# Altium schematic sheet 如意硬件系统模块0831.SchDoc
size C
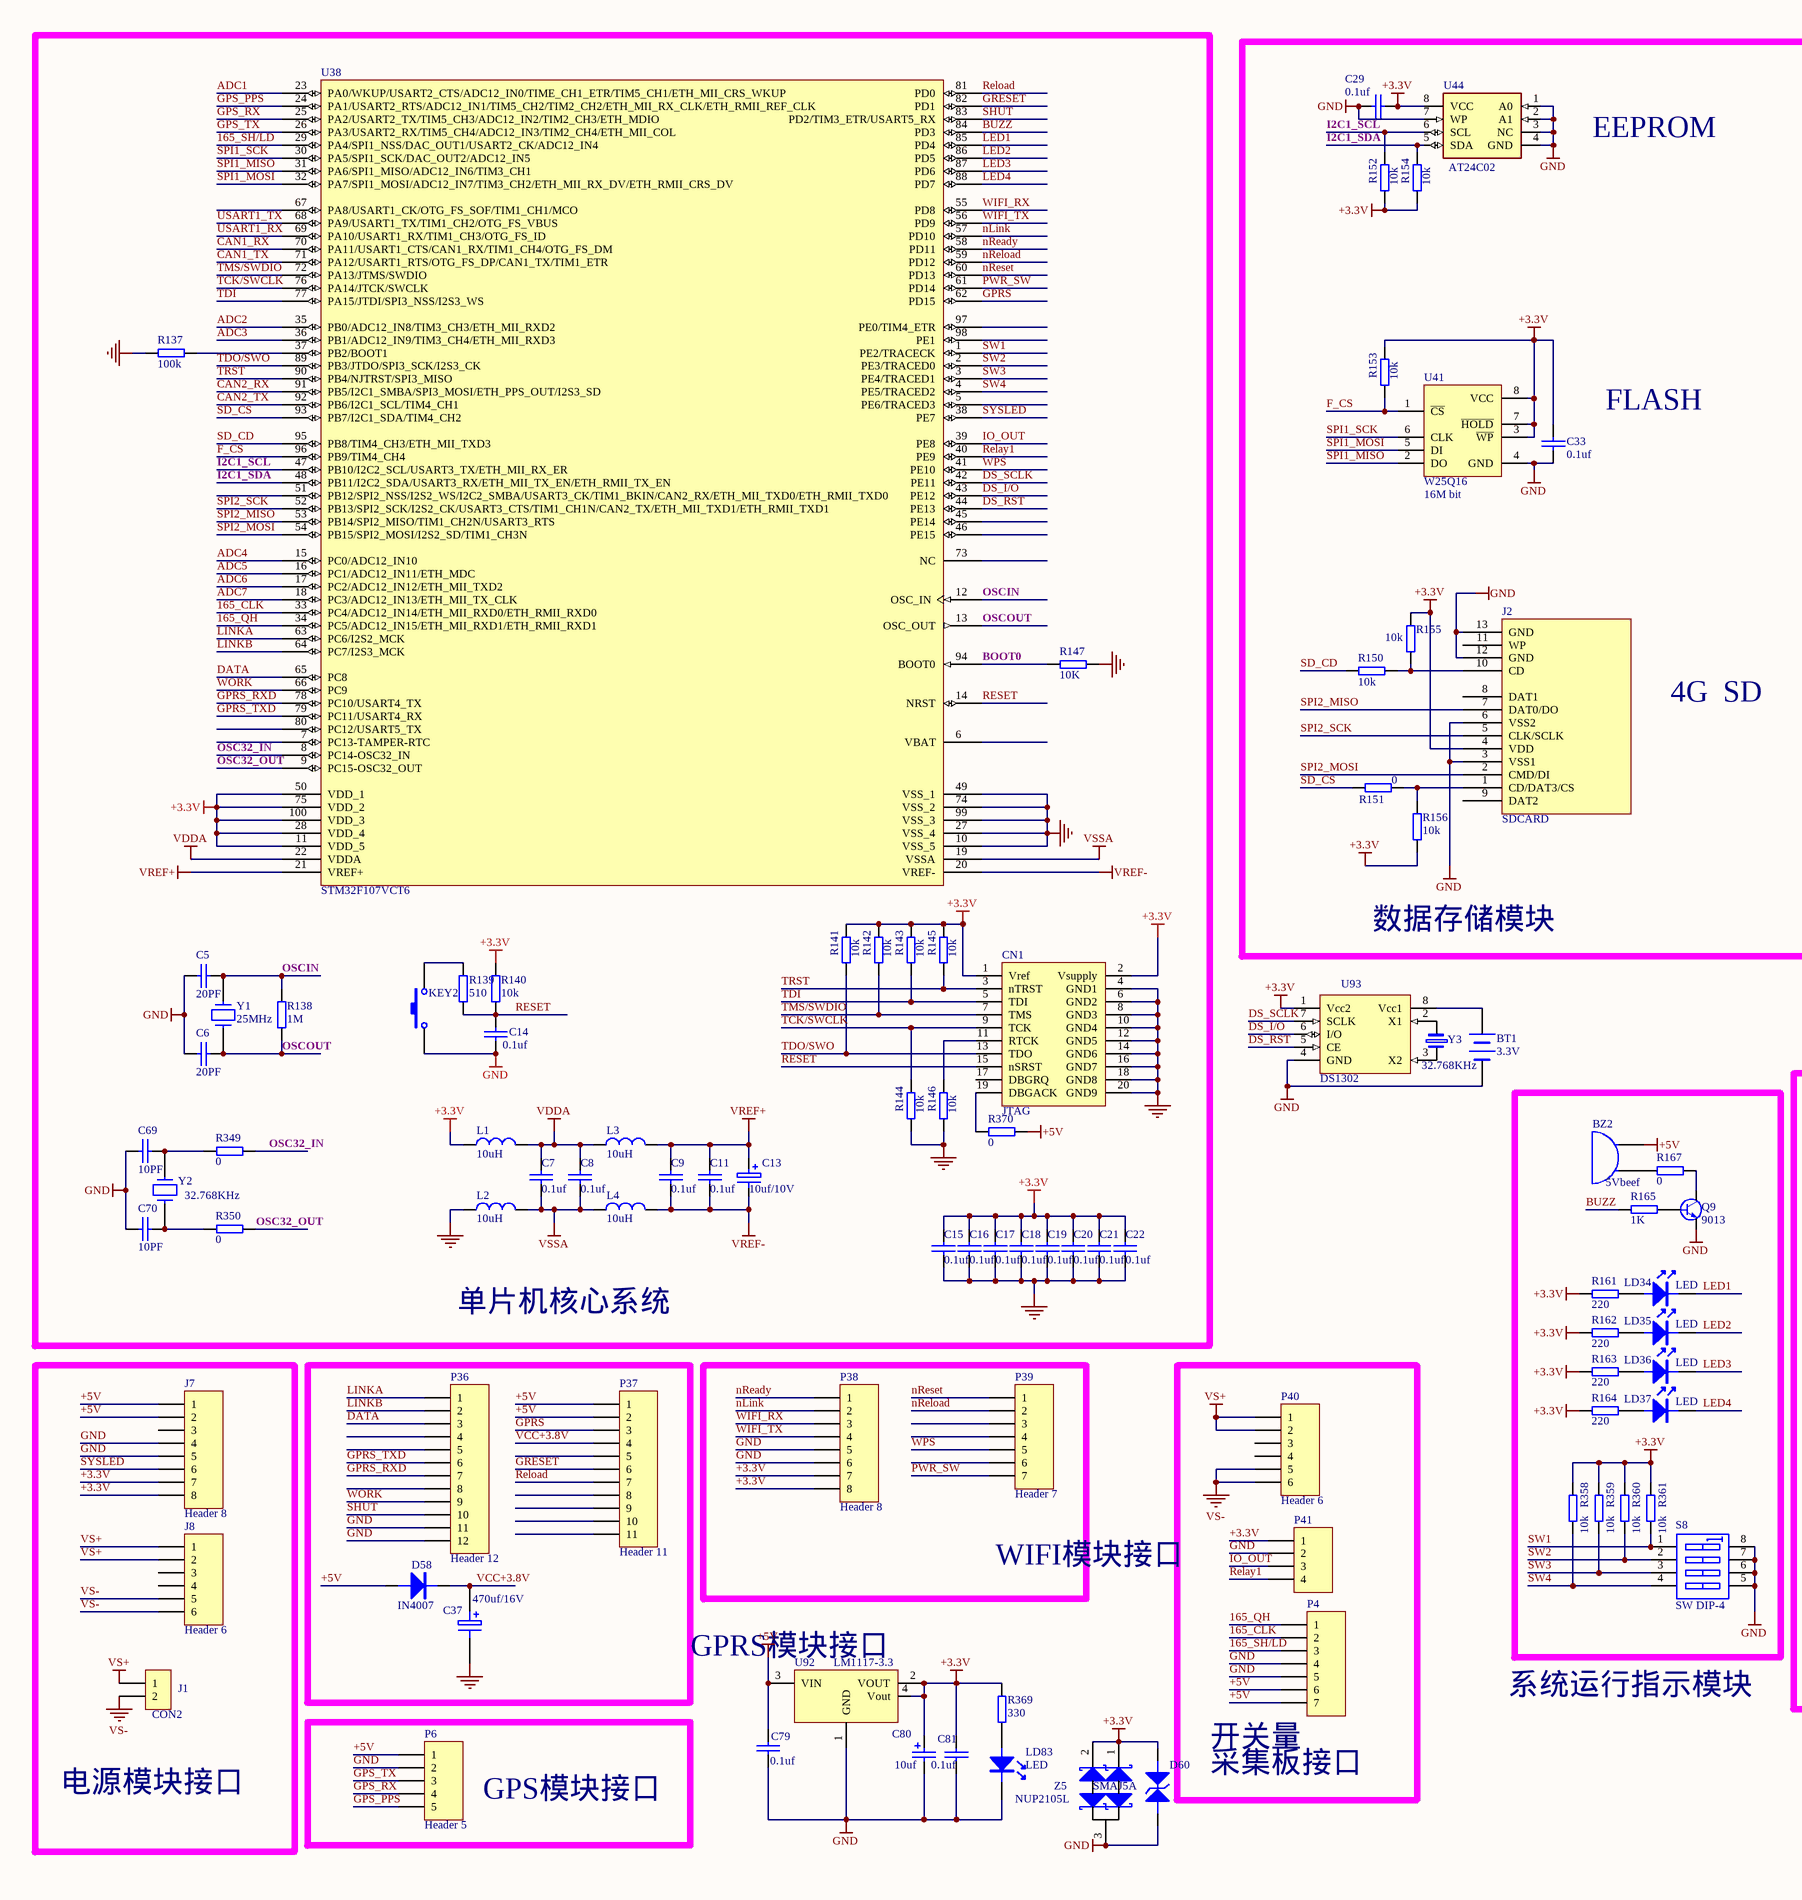
[diagram p0: 如意硬件系统模块0831.SchDoc, left]
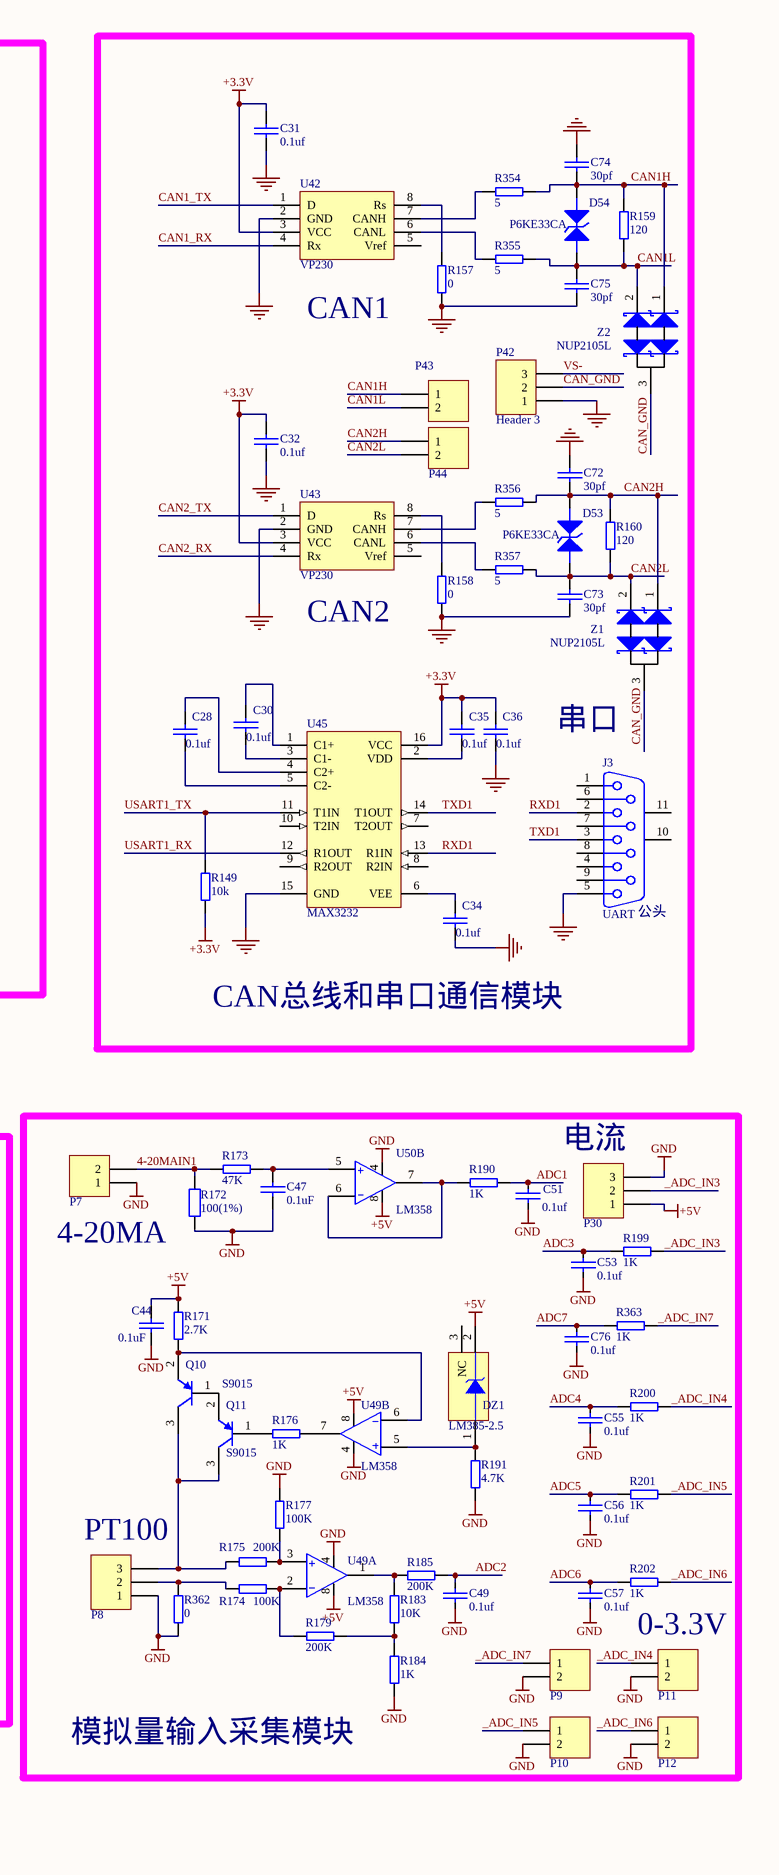
[diagram p1: 如意硬件系统模块0831.SchDoc, right]

## Parts
BT1  3.3V  [BT2]
BZ2  5Vbeef  [BEEP]
C5  20PF  [0603C-1]
C6  20PF  [0603C-1]
C7  0.1uf  [0603C-1]
C8  0.1uf  [0603C-1]
C9  0.1uf  [0603C-1]
C11  0.1uf  [0603C-1]
C13  10uf/10V  [1206D-S]
C14  0.1uf  [0603C-1]
C15  0.1uf  [0603C-1]
C16  0.1uf  [0603C-1]
C17  0.1uf  [0603C-1]
C18  0.1uf  [0603C-1]
C19  0.1uf  [0603C-1]
C20  0.1uf  [0603C-1]
C21  0.1uf  [0603C-1]
C22  0.1uf  [0603C-1]
C28  0.1uf  [0603C-1]
C29  0.1uf  [0603C-1]
C30  0.1uf  [0603C-1]
C31  0.1uf  [0603C-1]
C32  0.1uf  [0603C-1]
C33  0.1uf  [0603C-1]
C34  0.1uf  [0603C-1]
C35  0.1uf  [0603C-1]
C36  0.1uf  [0603C-1]
C37  470uf/16V  [C-RB-10]
C44  0.1uF  [0603C-1]
C47  0.1uF  [0603C-1]
C49  0.1uf  [0805-1]
C51  0.1uf  [0603C-1]
C53  0.1uf  [0603C-1]
C55  0.1uf  [0603C-1]
C56  0.1uf  [0603C-1]
C57  0.1uf  [0603C-1]
C69  10PF  [0603C-1]
C70  10PF  [0603C-1]
C72  30pf  [0805-1]
C73  30pf  [0805-1]
C74  30pf  [0805-1]
C75  30pf  [0805-1]
C76  0.1uf  [0603C-1]
C79  0.1uf  [0603C-1]
C80  10uf  [1206D-S]
C81  0.1uf  [0603C-1]
CN1  JTAG  [JTAG20 - 15]
D53  P6KE33CA  [SMB]
D54  P6KE33CA  [SMB]
D58  IN4007  [SMB]
D60  SMAJ5A  [SMB]
DZ1  LM385-2.5  [TO-92A]
J1  CON2  [JXZ-2]
J2  SDCARD  [SDC009-01-R2]
J3  UART  [DB9-M]
J7  Header 8  [HDR1X8]
J8  Header 6  [HDR1X6]
KEY2  SW-PB  [SW_PB4_A1]  (value not drawn)
L1  value 10uH  [1206]  (hidden comment: Inductor)
L2  value 10uH  [1206]  (hidden comment: Inductor)
L3  value 10uH  [1206]  (hidden comment: Inductor)
L4  value 10uH  [1206]  (hidden comment: Inductor)
LD34  LED  [LED_0805]
LD35  LED  [LED_0805]
LD36  LED  [LED_0805]
LD37  LED  [LED_0805]
LD83  LED  [LED_0805]
P4  Header 7  [HDR1X7]  (value not drawn)
P6  Header 5  [HDR1X5]
P7  Header 2  [KF3.81-2P]  (value not drawn)
P8  Header 3  [KF3.81-3P]  (value not drawn)
P9  Header 2  [KF3.81-2P]  (value not drawn)
P10  Header 2  [KF3.81-2P]  (value not drawn)
P11  Header 2  [KF3.81-2P]  (value not drawn)
P12  Header 2  [KF3.81-2P]  (value not drawn)
P30  Header 3  [KF3.81-3P]  (value not drawn)
P36  Header 12  [HDR1X12]
P37  Header 11  [HDR1X11]
P38  Header 8  [HDR1X8]
P39  Header 7  [HDR1X7]
P40  Header 6  [HDR1X6]
P41  Header 4  [HDR1X4]  (value not drawn)
P42  Header 3  [HDR1X3]
P43  Header 2  [KF3.81-2P]  (value not drawn)
P44  Header 2  [KF3.81-2P]  (value not drawn)
Q9  9013  [SOT23-BCE]
Q10  S9015  [SOT-23]
Q11  S9015  [SOT-23]
R137  100k  [0603R-1]
R138  1M  [0603R-1]
R139  510  [0603R-1]
R140  10k  [0603R-1]
R141  10k  [0603R-1]
R142  10k  [0603R-1]
R143  10k  [0603R-1]
R144  10k  [0603R-1]
R145  10k  [0603R-1]
R146  10k  [0603R-1]
R147  10K  [0603R-1]
R149  10k  [0603R-1]
R150  10k  [0603R-1]
R151  0  [0603R-1]
R152  10k  [0603R-1]
R153  10k  [0603R-1]
R154  10k  [0603R-1]
R155  10k  [0603R-1]
R156  10k  [0603R-1]
R157  0  [0603R-1]
R158  0  [0603R-1]
R159  120  [0805-1]
R160  120  [0805-1]
R161  220  [0603R-1]
R162  220  [0603R-1]
R163  220  [0603R-1]
R164  220  [0603R-1]
R165  1K  [0603R-1]
R167  0  [0603R-1]
R171  2.7K  [AXIAL0.4]
R172  100(1%)  [AXIAL0.4]
R173  47K  [0603R-1]
R174  100K  [0805-1]
R175  200K  [0805-1]
R176  1K  [0603R-1]
R177  100K  [0805-1]
R179  200K  [0805-1]
R183  10K  [0805-1]
R184  1K  [0805-1]
R185  200K  [0805-1]
R190  1K  [0603R-1]
R191  4.7K  [0603R-1]
R199  1K  [0603R-1]
R200  1K  [0603R-1]
R201  1K  [0603R-1]
R202  1K  [0603R-1]
R349  0  [0603R-1]
R350  0  [0603R-1]
R354  5  [0805-1]
R355  5  [0805-1]
R356  5  [0805-1]
R357  5  [0805-1]
R358  10k  [0603R-1]
R359  10k  [0603R-1]
R360  10k  [0603R-1]
R361  10k  [0603R-1]
R362  0  [0603R-1]
R363  1K  [0603R-1]
R369  330  [0603R-1]
R370  0  [0603R-1]
S8  SW DIP-4  [DIP-8]
U38  STM32F107VCT6  [LQFP100_M]
U41  W25Q16  Memory: 16M bit  [SOIC8_W]
U42  VP230  [NSO8_N]
U43  VP230  [NSO8_N]
U44  AT24C02  [SO-8]
U45  MAX3232  [NSO16_M]
U49  LM358  [SO-8]  (parts A,B of 2)
U50  LM358  [SO-8]  (part B of 2)
U92  LM1117-3.3  [ASM1117]
U93  DS1302  [SO-8]
Y1  25MHz  [XTAL1]
Y2  32.768KHz  [XTAL4]
Y3  32.768KHz  [XTAL5]
Z1  NUP2105L  [SOT-23]
Z2  NUP2105L  [SOT-23]
Z5  NUP2105L  [SOT-23]

## Blocks framed on the sheet
单片机核心系统: C5-C9 C11 C13-C22 C69 C70 CN1 KEY2 L1-L4 R137-R147 R349 R350 R370 U38 Y1 Y2
电源模块接口: J1 J7 J8
WIFI模块接口: P38 P39
GPS模块接口: P6

## Nets
+3.3V: C15.2 C16.2 C17.2 C18.2 C19.2 C20.2 C21.2 C22.2 C29.2 C31.2 C32.2 C33.2 C35.2 C36.2 C80.1 C81.2 CN1.1(Vref) CN1.2(Vsupply) D60.2(K) J2.4(VDD) J7.7 J7.8 L1.1 P38.7 P38.8 P41.1 R140.2 R141.2 R142.2 R143.2 R145.2 R149.2 R152.1 R153.2 R154.1 R155.1 R156.2 R161.1 R162.1 R163.1 R164.1 R358.2 R359.2 R360.2 R361.2 R369.1 U38.11(VDD_5) U38.28(VDD_4) U38.50(VDD_1) U38.75(VDD_2) U38.100(VDD_3) U41.3(~{WP}) U41.7(~{HOLD}) U41.8(VCC) U42.3(VCC) U43.3(VCC) U44.8(VCC) U45.16(VCC) U92.2(VOUT) U92.4(Vout) U93.1(Vcc2) Z5.1 Z5.2
+5V: BZ2.1(A) C44.2 C79.2 D58.1(A) DZ1.2(V+) J7.1 J7.2 P4.6 P4.7 P6.1 P30.1 P37.1 P37.2 R171.2 R370.1 U49.8(VCC) U50.8(VCC) U92.3(VIN)
GND: BT1.2(-) C5.1 C6.1 C14.2 C15.1 C16.1 C17.1 C18.1 C19.1 C20.1 C21.1 C22.1 C29.1 C31.1 C32.1 C33.1 C34.1 C36.1 C37.2 C44.1 C47.1 C49.2 C51.2 C53.2 C55.2 C56.2 C57.2 C69.1 C70.1 C72.2 C73.1 C74.2 C75.1 C76.2 C79.1 C80.2 C81.1 CN1.4(GND1) CN1.6(GND2) CN1.8(GND3) CN1.10(GND4) CN1.12(GND5) CN1.14(GND6) CN1.16(GND7) CN1.18(GND8) CN1.20(GND9) D60.1(A) J2.3(VSS1) J2.6(VSS2) J2.12(GND) J2.13(GND) J3.5 J7.4 J7.5 KEY2.1 L2.1 LD83.2 P4.4 P4.5 P6.2 P7.1 P8.1 P9.2 P10.2 P11.2 P12.2 P30.3 P36.11 P36.12 P38.5 P38.6 P41.2 P42.1 Q9.E R137.2 R144.1 R146.1 R147.1 R157.2 R158.2 R172.1 R177.1 R184.2 R191.2 R362.1 S8.5(B4) S8.6(B3) S8.7(B2) S8.8(B1) U38.10(VSS_5) U38.27(VSS_4) U38.49(VSS_1) U38.74(VSS_2) U38.99(VSS_3) U41.4(GND) U42.2(GND) U43.2(GND) U44.1(A0) U44.2(A1) U44.3(NC) U44.4(GND) U44.7(WP) U45.15(GND) U49.4(GND) U50.4(GND) U92.1(GND) U93.4(GND) Z5.3
VDDA: C7.2 C8.2 L1.2 L3.1 U38.22(VDDA)
VREF+: C9.2 C11.2 C13.1 L3.2 U38.21(VREF+)
VREF-: C9.1 C11.1 C13.2 L4.2 U38.20(VREF-)
VS+: J1.1 J8.1 J8.2 P40.1 P40.2
VS-: J1.2 J8.5 J8.6 P40.5 P40.6 P42.3
VSSA: C7.1 C8.1 L2.2 L4.1 U38.19(VSSA)
4-20MAIN1: P7.2 R172.2 R173.2
165_CLK: P4.2 U38.33(PC4/ADC12_IN14/ETH_MII_RXD0/ETH_RMII_RXD0)
165_QH: P4.1 U38.34(PC5/ADC12_IN15/ETH_MII_RXD1/ETH_RMII_RXD1)
165_SH/LD: P4.3 U38.29(PA4/SPI1_NSS/DAC_OUT1/USART2_CK/ADC12_IN4)
_ADC_IN3: P30.2 R199.2
_ADC_IN4: P11.1 R200.2
_ADC_IN5: P10.1 R201.2
_ADC_IN6: P12.1 R202.2
_ADC_IN7: P9.1 R363.2
ADC1: C51.1 R190.2 U38.23(PA0/WKUP/USART2_CTS/ADC12_IN0/TIME_CH1_ETR/TIM5_CH1/ETH_MII_CRS_WKUP)
ADC2: C49.1 R185.2 U38.35(PB0/ADC12_IN8/TIM3_CH3/ETH_MII_RXD2)
ADC3: C53.1 R199.1 U38.36(PB1/ADC12_IN9/TIM3_CH4/ETH_MII_RXD3)
ADC4: C55.1 R200.1 U38.15(PC0/ADC12_IN10)
ADC5: C56.1 R201.1 U38.16(PC1/ADC12_IN11/ETH_MDC)
ADC6: C57.1 R202.1 U38.17(PC2/ADC12_IN12/ETH_MII_TXD2)
ADC7: C76.1 R363.1 U38.18(PC3/ADC12_IN13/ETH_MII_TX_CLK)
BOOT0: R147.2 U38.94(BOOT0)
BUZZ: R165.2 U38.84(PD3)
CAN1_RX: U38.70(PA11/USART1_CTS/CAN1_RX/TIM1_CH4/OTG_FS_DM) U42.4(Rx)
CAN1_TX: U38.71(PA12/USART1_RTS/OTG_FS_DP/CAN1_TX/TIM1_ETR) U42.1(D)
CAN1H: C74.1 D54.2(K) P43.1 R159.1 R354.2 Z2.1
CAN1L: C75.2 D54.1(A) P43.2 R159.2 R355.2 Z2.2
CAN2_RX: U38.91(PB5/I2C1_SMBA/SPI3_MOSI/ETH_PPS_OUT/I2S3_SD) U43.4(Rx)
CAN2_TX: U38.92(PB6/I2C1_SCL/TIM4_CH1) U43.1(D)
CAN2H: C72.1 D53.2(K) P44.1 R160.1 R356.2 Z1.1
CAN2L: C73.2 D53.1(A) P44.2 R160.2 R357.2 Z1.2
CAN_GND: P42.2 Z1.3 Z2.3
DATA: P36.3 U38.65(PC8)
DS_I/O: U38.43(PE12) U93.6(I/O)
DS_RST: U38.44(PE13) U93.5(CE)
DS_SCLK: U38.42(PE11) U93.7(SCLK)
F_CS: R153.1 U38.96(PB9/TIM4_CH4) U41.1(~{CS})
GPRS: P37.3 U38.62(PD15)
GPRS_RXD: P36.7 U38.78(PC10/USART4_TX)
GPRS_TXD: P36.6 U38.79(PC11/USART4_RX)
GPS_PPS: P6.5 U38.24(PA1/USART2_RTS/ADC12_IN1/TIM5_CH2/TIM2_CH2/ETH_MII_RX_CLK/ETH_RMII_REF_CLK)
GPS_RX: P6.4 U38.25(PA2/USART2_TX/TIM5_CH3/ADC12_IN2/TIM2_CH3/ETH_MDIO)
GPS_TX: P6.3 U38.26(PA3/USART2_RX/TIM5_CH4/ADC12_IN3/TIM2_CH4/ETH_MII_COL)
GRESET: P37.6 U38.82(PD1)
I2C1_SCL: R152.2 U38.47(PB10/I2C2_SCL/USART3_TX/ETH_MII_RX_ER) U44.6(SCL)
I2C1_SDA: R154.2 U38.48(PB11/I2C2_SDA/USART3_RX/ETH_MII_TX_EN/ETH_RMII_TX_EN) U44.5(SDA)
IO_OUT: P41.3 U38.39(PE8)
LED1: LD34.2 U38.85(PD4)
LED2: LD35.2 U38.86(PD5)
LED3: LD36.2 U38.87(PD6)
LED4: LD37.2 U38.88(PD7)
LINKA: P36.1 U38.63(PC6/I2S2_MCK)
LINKB: P36.2 U38.64(PC7/I2S3_MCK)
nLink: P38.2 U38.57(PD10)
nReady: P38.1 U38.58(PD11)
nReload: P39.2 U38.59(PD12)
nReset: P39.1 U38.60(PD13)
OSC32_IN: R349.1 U38.8(PC14-OSC32_IN)
OSC32_OUT: R350.1 U38.9(PC15-OSC32_OUT)
OSCIN: C5.2 R138.2 U38.12(OSC_IN) Y1.1
OSCOUT: C6.2 R138.1 U38.13(OSC_OUT) Y1.2
PWR_SW: P39.7 U38.61(PD14)
Relay1: P41.4 U38.40(PE9)
Reload: P37.7 U38.81(PD0)
RESET: C14.1 CN1.15(nSRST) R139.1 R140.1 U38.14(NRST)
RXD1: J3.2 U45.13(R1IN)
SD_CD: R150.2 U38.95(PB8/TIM4_CH3/ETH_MII_TXD3)
SD_CS: R151.2 U38.93(PB7/I2C1_SDA/TIM4_CH2)
SHUT: P36.10 U38.83(PD2/TIM3_ETR/USART5_RX)
SPI1_MISO: U38.31(PA6/SPI1_MISO/ADC12_IN6/TIM3_CH1) U41.2(DO)
SPI1_MOSI: U38.32(PA7/SPI1_MOSI/ADC12_IN7/TIM3_CH2/ETH_MII_RX_DV/ETH_RMII_CRS_DV) U41.5(DI)
SPI1_SCK: U38.30(PA5/SPI1_SCK/DAC_OUT2/ADC12_IN5) U41.6(CLK)
SPI2_MISO: J2.7(DAT0/DO) U38.53(PB14/SPI2_MISO/TIM1_CH2N/USART3_RTS)
SPI2_MOSI: J2.2(CMD/DI) U38.54(PB15/SPI2_MOSI/I2S2_SD/TIM1_CH3N)
SPI2_SCK: J2.5(CLK/SCLK) U38.52(PB13/SPI2_SCK/I2S2_CK/USART3_CTS/TIM1_CH1N/CAN2_TX/ETH_MII_TXD1/ETH_RMII_TXD1)
SW1: R361.1 S8.1(A1) U38.1(PE2/TRACECK)
SW2: R360.1 S8.2(A2) U38.2(PE3/TRACED0)
SW3: R359.1 S8.3(A3) U38.3(PE4/TRACED1)
SW4: R358.1 S8.4(A4) U38.4(PE5/TRACED2)
SYSLED: J7.6 U38.38(PE7)
TCK/SWCLK: CN1.9(TCK) R144.2 U38.76(PA14/JTCK/SWCLK)
TDI: CN1.5(TDI) R143.1 U38.77(PA15/JTDI/SPI3_NSS/I2S3_WS)
TDO/SWO: CN1.13(TDO) R141.1 U38.89(PB3/JTDO/SPI3_SCK/I2S3_CK)
TMS/SWDIO: CN1.7(TMS) R142.1 U38.72(PA13/JTMS/SWDIO)
TRST: CN1.3(nTRST) R145.1 U38.90(PB4/NJTRST/SPI3_MISO)
TXD1: J3.3 U45.14(T1OUT)
USART1_RX: U38.69(PA10/USART1_RX/TIM1_CH3/OTG_FS_ID) U45.12(R1OUT)
USART1_TX: R149.1 U38.68(PA9/USART1_TX/TIM1_CH2/OTG_FS_VBUS) U45.11(T1IN)
VCC+3.8V: C37.1 D58.2(K) P37.4
WIFI_RX: P38.3 U38.55(PD8)
WIFI_TX: P38.4 U38.56(PD9)
WORK: P36.9 U38.66(PC9)
WPS: P39.5 U38.41(PE10)
NetBT1_1: BT1.1(+) U93.8(Vcc1)
NetBZ2_2: BZ2.2(B) R167.1
NetC28_1: C28.1 U45.5(C2-)
NetC28_2: C28.2 U45.4(C2+)
NetC30_1: C30.1 U45.3(C1-)
NetC30_2: C30.2 U45.1(C1+)
NetC34_2: C34.2 U45.6(VEE)
NetC35_1: C35.1 U45.2(VDD)
NetC47_2: C47.2 R173.1 U50.5
NetC69_2: C69.2 R349.2 Y2.1
NetC70_2: C70.2 R350.2 Y2.2
NetCN1_11: CN1.11(RTCK) R146.2
NetCN1_19: CN1.19(DBGACK) R370.2
NetDZ1_1: DZ1.1(V-) R191.1 U49.5
NetJ2_1: J2.1(CD/DAT3/CS) R151.1 R156.1
NetJ2_10: J2.10(CD) R150.1 R155.2
NetKEY2_2: KEY2.2 R139.2
NetLD34_1: LD34.1 R161.2
NetLD35_1: LD35.1 R162.2
NetLD36_1: LD36.1 R163.2
NetLD37_1: LD37.1 R164.2
NetLD83_1: LD83.1 R369.2
NetP8_2: P8.2 R174.2 R362.2
NetP8_3: P8.3 Q10.3(C) Q11.3(C) R175.2
NetQ9_B: Q9.B R165.1
NetQ9_C: Q9.C R167.2
NetQ10_1: Q10.1(B) Q11.2(E)
NetQ10_2: Q10.2(E) R171.1 U49.6
NetQ11_1: Q11.1(B) R176.2
NetR137_1: R137.1 U38.37(PB2/BOOT1)
NetR157_1: R157.1 U42.8(Rs)
NetR158_1: R158.1 U43.8(Rs)
NetR174_1: R174.1 R179.1 U49.2
NetR175_1: R175.1 R177.2 U49.3
NetR176_1: R176.1 U49.7
NetR179_2: R179.2 R183.2 R184.1
NetR183_1: R183.1 R185.1 U49.1
NetR190_1: R190.1 U50.6 U50.7
NetR354_1: R354.1 U42.7(CANH)
NetR355_1: R355.1 U42.6(CANL)
NetR356_1: R356.1 U43.7(CANH)
NetR357_1: R357.1 U43.6(CANL)
NetU93_2: U93.2(X1) Y3.2
NetU93_3: U93.3(X2) Y3.1

Not connected (* = marked no-connect by the designer): CN1 17(DBGRQ); DZ1 3(NC); J2 8(DAT1) 9(DAT2) 11(WP); J3 1 4 6 7 8 9 10(MH1) 11(MH2); J7 3; J8 3 4; P36 4 5 8; P37 5 8 9 10 11; P39 3 4 6; P40 3 4; U38 5(PE6/TRACED3) 6(VBAT) 7(PC13-TAMPER-RTC) 45(PE14) 46(PE15) 51(PB12/SPI2_NSS/I2S2_WS/I2C2_SMBA/USART3_CK/TIM1_BKIN/CAN2_RX/ETH_MII_TXD0/ETH_RMII_TXD0) 67(PA8/USART1_CK/OTG_FS_SOF/TIM1_CH1/MCO) 73(NC) 80(PC12/USART5_TX) 97(PE0/TIM4_ETR) 98(PE1); U42 5(Vref); U43 5(Vref); U45 7(T2OUT) 8(R2IN) 9(R2OUT) 10(T2IN)

## Notes on the sheet
- EEPROM
- CAN1
- FLASH
- (near U43) CAN2
- 4G  SD
- 串口
- (near J3) 公头
- 数据存储模块
- CAN总线和串口通信模块
- 电流
- 4-20MA
- (near P8) PT100
- 0-3.3V
- GPRS模块接口
- 模拟量输入采集模块
- 系统运行指示模块
- 开关量
- 采集板接口

## Library data of the parts
BT1 = BATTERY
BZ2 = BUZZER
C5-C9 C11 C14-C22 C28-C36 C44 C47 C69 C70 C72-C75 = CAP: Capacitor
C13 = JXC
C37 = ELECTRO1: Electrolytic Capacitor
C49 C51 C53 C55-C57 C76 = C
C79 C81 = CAP0: CAP
C80 = ECAP
CN1 = JTAG20
D53 D54 D60 = TVS
D58 = DIODE
DZ1 = LM385BYZ-2.5: Micropower Voltage Reference Diode; Published: 15-Apr-2002; DatasheetVersion: Dec-1999; PackageVersion: 2000; PackageReference: Z03A; Publisher: Altium Limited; PackageDescription: TO, Flat Index; 3 In-Line, Axial Leads; Body Dia. 4.6mm; Leads 0.53 x 0.39 mm (max); ComponentLink1Description: Manufacturer Link; ComponentLink1URL: http://www.national.com/; ComponentLink2Description: Datasheet; ComponentLink2URL: http://www.national.com/ds.cgi/LM/LM185-2.5.pdf; ComponentLink3Description: URL Link1; ComponentLink3URL: http://www.national.com/pf/LM/LM385-2.5.html
J1 = CON2: Connector
J2 = SDCARD: SD卡自弹
J3 = D Connector 9: Receptacle Assembly, 9 Position, Right Angle; PackageDocument: O; Positions: 9; Published: 15-Jun-2001; LatestRevisionDate: 17-Jul-2002; LatestRevisionNote: Re-released for DXP Platform.; DatasheetDocument: 1-Sep-1999; PackageReference: 788750; Publisher: Altium Limited; Orientation: Right Angle; Gender: Receptacle
J7 P38 = Header 8: Header, 8-Pin; LatestRevisionDate: 17-Jul-2002; LatestRevisionNote: Re-released for DXP Platform.; Publisher: Altium Limited
J8 = Header 6: 接插件; LatestRevisionDate: 17-Jul-2002; LatestRevisionNote: Re-released for DXP Platform.; Publisher: Altium Limited
KEY2 = SW-PB: Switch; Published: 24-Mar-1999; LatestRevisionDate: 17-Jul-2002; LatestRevisionNote: Re-released for DXP Platform.; PackageReference: SPST-2; Publisher: Altium Limited
L1-L4 = Inductor: 电感; Code_IEC: 1005; Published: 8-Jun-2000; LatestRevisionDate: 17-Jul-2002; LatestRevisionNote: Re-released for DXP Platform.; PackageReference: 0402-A; Publisher: Altium Limited; Code_JEITA: 0402
P4 P39 = Header 7: Header, 7-Pin; LatestRevisionDate: 17-Jul-2002; LatestRevisionNote: Re-released for DXP Platform.; Publisher: Altium Limited
P6 = Header 5: Header, 5-Pin; LatestRevisionDate: 17-Jul-2002; LatestRevisionNote: Re-released for DXP Platform.; Publisher: Altium Limited
P7 P9-P12 P43 P44 = Header 2: 接插件; LatestRevisionDate: 17-Jul-2002; LatestRevisionNote: Re-released for DXP Platform.; Publisher: Altium Limited
P8 P30 = Header 3: 接插件; LatestRevisionDate: 17-Jul-2002; LatestRevisionNote: Re-released for DXP Platform.; Publisher: Altium Limited
P36 = Header 12: Header, 12-Pin; LatestRevisionDate: 17-Jul-2002; LatestRevisionNote: Re-released for DXP Platform.; Publisher: Altium Limited
P37 = Header 11: Header, 11-Pin; LatestRevisionDate: 17-Jul-2002; LatestRevisionNote: Re-released for DXP Platform.; Publisher: Altium Limited
P40 = Header 6: Header, 6-Pin; LatestRevisionDate: 17-Jul-2002; LatestRevisionNote: Re-released for DXP Platform.; Publisher: Altium Limited
P41 = Header 4: Header, 4-Pin; LatestRevisionDate: 17-Jul-2002; LatestRevisionNote: Re-released for DXP Platform.; Publisher: Altium Limited
P42 = Header 3: Header, 3-Pin; LatestRevisionDate: 17-Jul-2002; LatestRevisionNote: Re-released for DXP Platform.; Publisher: Altium Limited
Q9 = NPN
Q10 Q11 = S9015_1: PNP三极管; Published: 8-Jun-2000; LatestRevisionDate: 15-Jan-2003; LatestRevisionNote: PCB Footprint 'BCY-W3/D4.7' replaced; DatasheetDocument: 1997; PackageDocument: Sep-1998; PackageReference: TO-92A; Publisher: Altium Limited; Code_JEDEC: TO-92A; ComponentLink1Description: Manufacturer Link; ComponentLink1URL: http://www.fairchildsemi.com/; ComponentLink2Description: Datasheet; ComponentLink2URL: http://www.fairchildsemi.com/ds/2N%2F2N3904.pdf
R137 R140-R146 R149-R160 R354-R362 R370 = RES2
R138 R139 R147 R161-R165 R167 R171 R173-R177 R179 R183-R185 R190 R191 R199-R202 R349 R350 R363 R369 = RES-2
R172 = Res2: Resistor; Published: 8-Jun-2000; LatestRevisionDate: 17-Jul-2002; LatestRevisionNote: Re-released for DXP Platform.; PackageReference: AXIAL-0.4; Publisher: Altium Limited
S8 = SW DIP-4: 编码开关; Published: 24-Mar-1999; LatestRevisionDate: 17-Jul-2002; LatestRevisionNote: Re-released for DXP Platform.; PackageReference: SO8; Publisher: Altium Limited; Code_JEDEC: MS-012-AA; Code_IPC: SO8
U41 = W25QXX: SPI FLASH
U42 U43 = SN65HVD230: CAN芯片
U44 = AT24C128
U45 = MAX232: +5V Powered, Multi-Channel RS-232 Driver/Receiver; Published: 16-Jan-2001; LatestRevisionDate: 13-Apr-2006; LatestRevisionNote: IPC-7351 Footprint Added.; PackageReference: NSO16; Publisher: Altium Limited; PackageDescription: 16-Pin Small Outline Integrated Circuit 1.27 mm Pitch; Code_JEDEC: MS-012-AC; Code_IPC: SOIC127P600-16; ComponentLink1Description: Manufacturer Link; ComponentLink1URL: http://www.maxim-ic.com/; ComponentLink2Description: Datasheet; ComponentLink2URL: http://pdfserv.maxim-ic.com/en/ds/MAX220-MAX249.pdf
U92 = LM1117
Y1 Y2 = CRYSTAL
Y3 = XTAL
Z1 Z2 Z5 = PESD1CAN: 过压保护